# EAGLE design bbps (EAGLE 8.0.1)
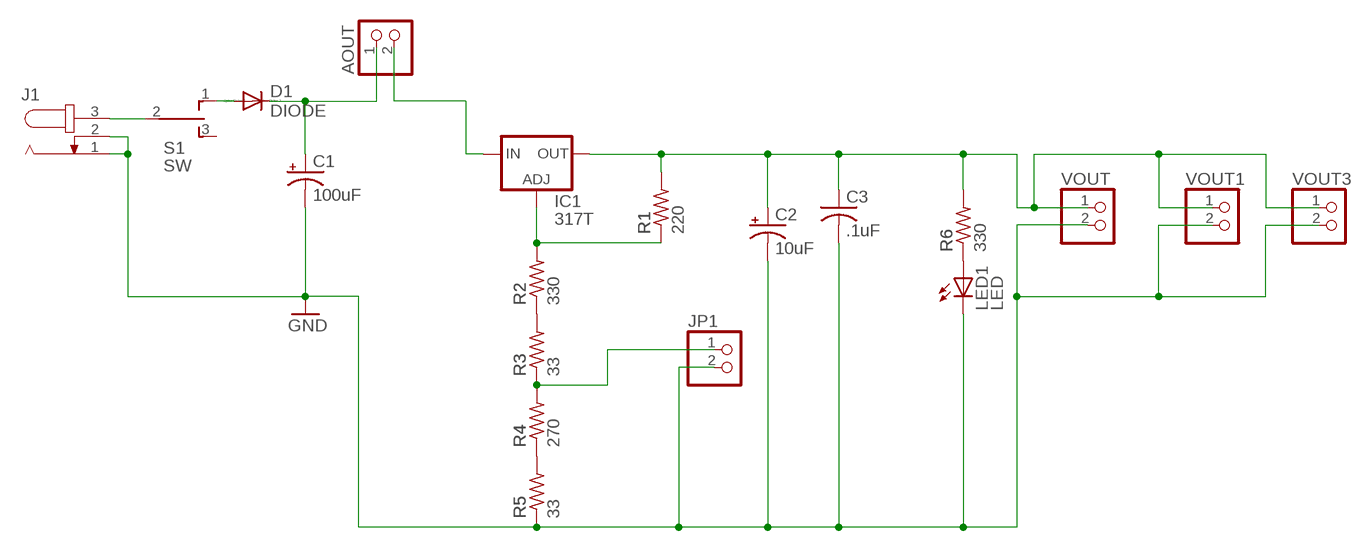
[diagram p0: schematic, sheet 1]

## Parts
AOUT  PINHD-1X2  [1X02]
C1  100uF  CPOL5MM  [CPOL_5MM]
C2  10uF  CPOL5MM  [CPOL_5MM]
C3  .1uF  C-US050-024X044  [C050-024X044]
D1  DIODE  [D40_10MM]
IC1  317T  [317T]
J1  JACK-PLUG0  [SPC4077]
JP1  PINHD-1X2  [1X02]
LED1  LED  [LED_2.54MM]
R1  220  R  [R207_7.6MM]
R2  330  R  [R207_7.6MM]
R3  33  R  [R207_7.6MM]
R4  270  R  [R207_7.6MM]
R5  33  R  [R207_7.6MM]
R6  330  R  [R207_7.6MM]
S1  SW  SWITCH  [SWITCH]
VOUT  PINHD-1X2  [1X02]
VOUT1  PINHD-1X2  [1X02]
VOUT3  PINHD-1X2  [1X02]

## Nets
GND: C1.- C2.- C3.2 J1.1 J1.2 JP1.2 LED1.K(C) R5.1 VOUT1.2 VOUT3.2 VOUT.2
N$1: J1.3 S1.2
N$2: D1.A S1.1
N$3: AOUT.1 C1.+ D1.C
N$4: C2.+ C3.1 IC1.2(OUT) R1.2 R6.2 VOUT1.1 VOUT3.1 VOUT.1
N$5: LED1.A R6.1
N$6: R4.1 R5.2
N$7: R2.1 R3.2
N$8: IC1.1(ADJ) R1.1 R2.2
N$9: JP1.1 R3.1 R4.2
N$10: AOUT.2 IC1.3(IN)
Unconnected: S1.3

## Library data of the parts
AOUT JP1 VOUT VOUT1 VOUT3 = pinhead:PINHD-1X2: PIN HEADER
C1 C2 = myLib:CPOL
C3 = rcl:C-US: CAPACITOR, American symbol
D1 = myLib:DIODE
IC1 = myLib:317T
J1 = con-jack:JACK-PLUG: DC POWER JACK Power Jack, DC, Right Angle, Through Hole, Rated 5A at 16VDC, PC Terminals Distributor: Farnell (www.Farnell.de) Drawing: 84N1161.pdf / 84N1162.pdf Manufacturer: SPC Technology (www.spctechnology.com) Type: SPC4077 / SPC 4078; OC_FARNELL: unknown; OC_NEWARK: unknown
LED1 = myLib:LED
R1-R6 = myLib:R
S1 = myLib:SWITCH

## Board
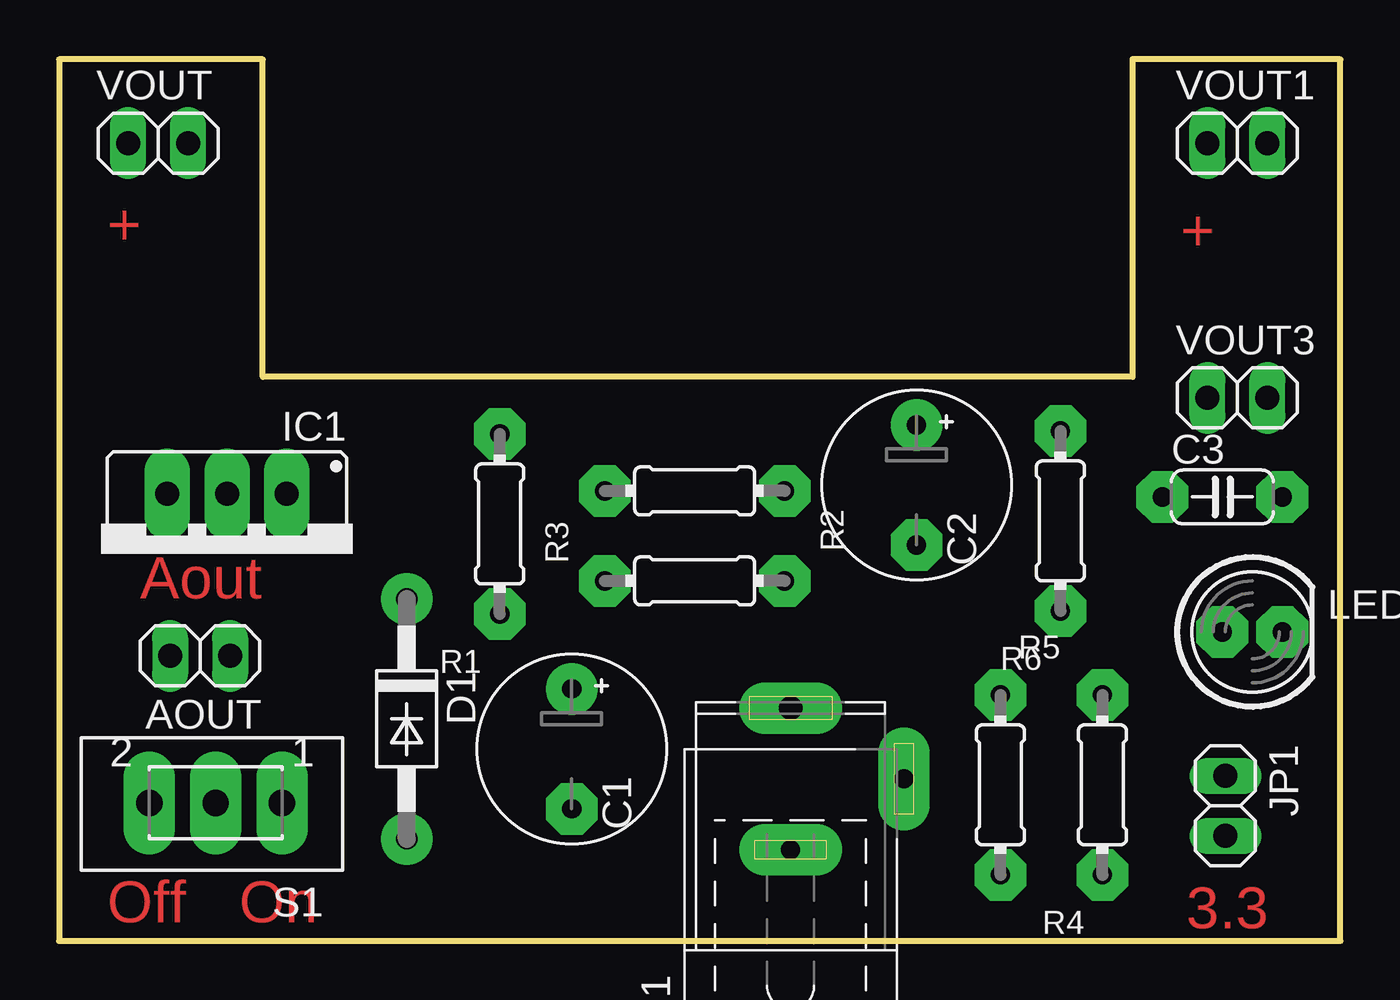
[diagram p1: board, top side]
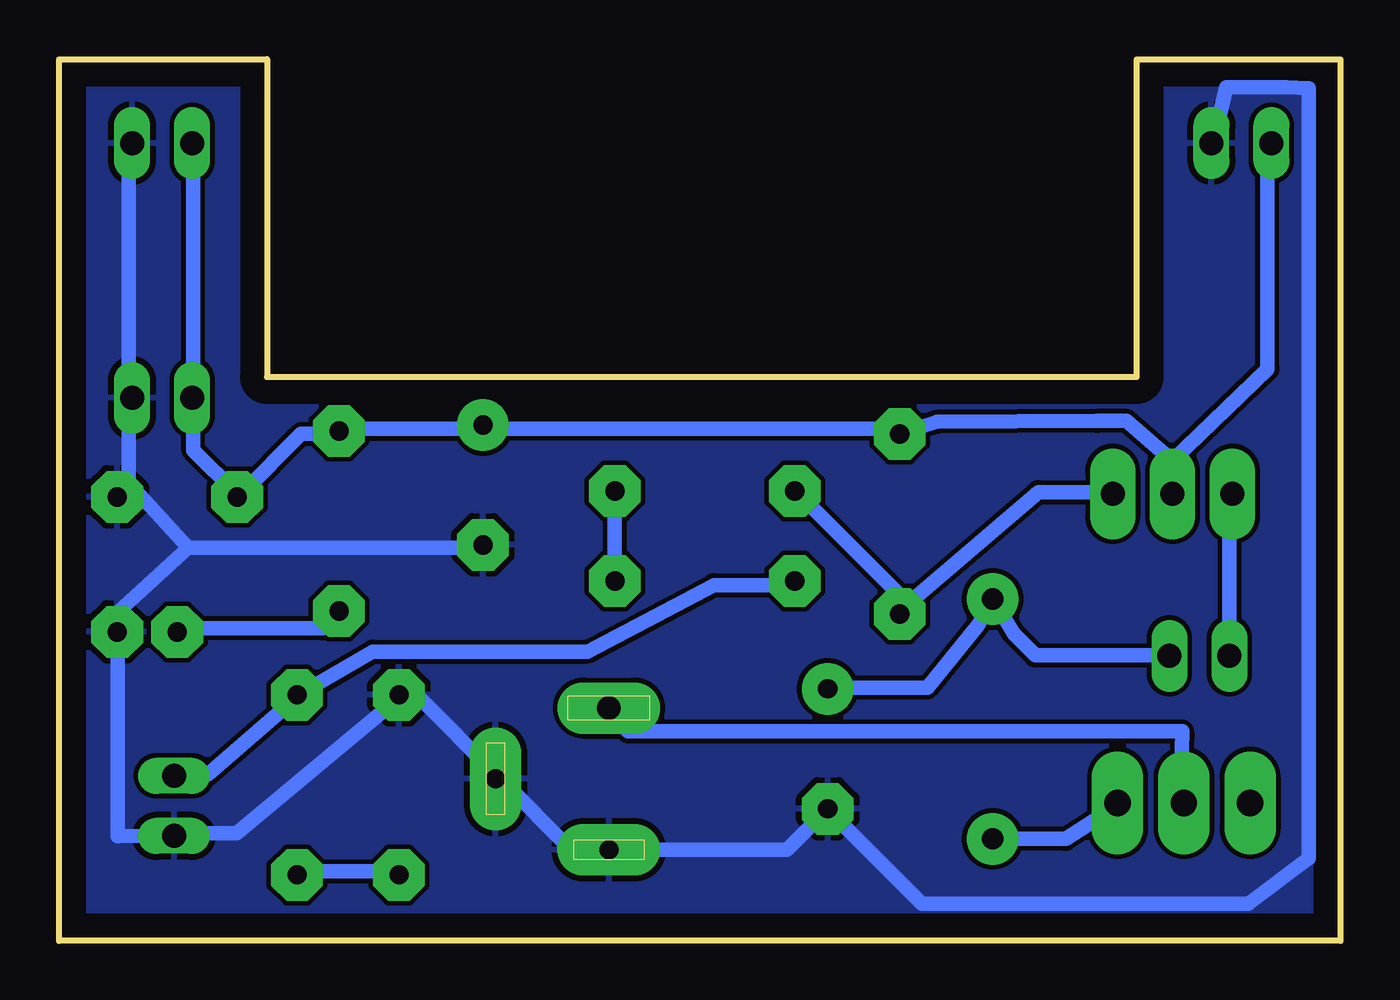
[diagram p2: board, bottom side, seen from below]

Size 54.28 x 37.34 mm. Coordinates in mm from the lower left corner, seen from the top.
Outline: 0,0 54.28,0 54.28,37.33 45.47,37.34 45.47,23.88 8.64,23.88 8.64,37.33 0,37.33 0,0
Copper layers (1*16): Top 0.035mm / dielectric 1.5mm / Bottom 0.035mm
Design rules "default": minimum track width 10mil, minimum drill 24mil, track to track 8mil, track to pad 8mil, pad to pad 8mil, via to via 8mil, smd to smd 8mil, copper to edge 40mil, drill to drill 8mil, minimum pad ring 10mil, minimum via ring 8mil, stop-mask expansion 4mil, vias tented up to drill 0mil, thermal gap 10mil

### Footprints (pad centres in the part's own frame; a part is rotated, then mirrored left to right if it is on the bottom)
1X02 = drill 1.016 long: 1 -1.27,0; 2 1.27,0
CPOL_5MM = drill 0.813 pad 2.184: + -2.54,0 | drill 0.813 pad 2.184 octagon: - 2.54,0
C050-024X044 = drill 0.813 pad 2.184 octagon: 1 -2.54,0; 2 2.54,0
D40_10MM = drill 0.9 pad 2.184: A 5.08,0; C -5.08,0
317T = drill 1.016 pad 1.93 long: 1 -2.54,-2.54; 2 0,-2.54; 3 2.54,-2.54
SPC4077 = drill 0.8 pad 2.184 long: 1 -3,0; 2 0,-4.8 | drill 1 pad 2.184 long: 3 3,0
LED_2.54MM = drill 0.813 pad 2.184 octagon: A -1.27,0; K 1.27,0
R207_7.6MM = drill 0.813 pad 2.184 octagon: 1 -3.81,0; 2 3.81,0
SWITCH = drill 1.118 pad 2.184 long: 1 -2.84,0; 2 -0.03,0; 3 2.78,0

### Placement (x,y rotation side)
AOUT  5.97,12.06 180 top
C1  21.72,8.13 270 top
C2  36.32,19.3 270 top
C3  49.28,18.8 0 top
D1  14.73,9.4 270 top
IC1  7.11,16.38 180 top
J1  30.99,6.86 90 top
JP1  49.4,5.72 270 top
LED1  50.55,13.08 0 top
R1  18.67,17.65 90 top
R2  26.92,19.05 180 top
R3  26.92,15.24 0 top
R4  44.2,6.6 90 top
R5  39.88,6.6 270 top
R6  42.42,17.78 90 top
S1  6.6,5.84 180 top
VOUT  4.19,33.78 0 top
VOUT1  49.91,33.78 0 top
VOUT3  49.91,22.99 0 top

### Tracks (layer width: path | path; a pad name or v marks a point on that pad's centre or on a via)
GND
  Bottom 0.61: 51.33,19.41 51.33,22.84 VOUT3.2 51.33,23.06 51.33,33.58 VOUT1.2 | 51.33,19.41 51.79,18.95 C3.2 51.33,19.41 | 48.82,16.64 36.6,16.64 C2.- | 51.33,19.41 48.82,16.64 | 48.82,16.64 51.79,13.92 51.79,13.23 LED1.K 51.79,13.01 51.79,4.42 JP1.2 49.28,4.55 46.76,4.55 39.9,10.26 R5.1 39.68,10.26 38.99,10.26 35.79,7.06 J1.2 35.56,6.83 32.59,3.86 J1.1 | VOUT.2 5.38,33.81 4.83,36.14 2.29,36.14 1.35,36.09 1.35,3.51 3.91,1.58 17.73,1.58 21.61,5.46 C1.- 23.44,3.86 J1.1 | J1.1
  pour Bottom: 0,37.34 8.64,37.34 8.64,23.88 45.47,23.88 45.47,37.34 54.23,37.34 54.23,0 0,0
N$1
  Bottom 0.61: S1.2 6.76,5.92 6.76,6.38 6.71,8.87 30.18,8.87 30.99,9.8 J1.3
N$2
  Bottom 0.61: D1.A 11.63,4.32 9.5,5.69 S1.1
N$3
  Bottom 0.61: AOUT.1 7.44,12.09 12.93,12.09 13.84,13.01 D1.C 15.34,13.39 17.5,10.72 21.61,10.72 C1.+
N$4
  Bottom 0.61: VOUT1.1 48.59,33.58 48.59,23.06 VOUT3.1 48.59,22.84 48.59,20.78 46.76,18.95 C3.1 46.53,18.95 44.02,21.46 42.42,21.46 R6.2 42.42,21.69 36.47,21.69 C2.+ 36.25,21.69 19.1,21.69 18.87,21.46 R1.2 17.09,21.97 10.31,22.02 9.07,22.02 7.11,20.32 | 7.11,20.32 3.1,24.21 3.1,33.58 VOUT.1 | 7.11,20.32 IC1.2
N$5
  Bottom 0.61: LED1.A 49.28,13.23 43.1,13.23 42.42,13.92 R6.1
N$6
  Bottom 0.61: R5.2 39.9,2.95 44.02,2.95 R4.1
N$7
  Bottom 0.61: R3.2 30.76,15.29 30.76,18.95 R2.1
N$8
  Bottom 0.61: 18.19,14.38 18.64,13.92 R1.1 18.19,14.38 | 18.19,14.38 12.8,19 9.98,19 IC1.1 | 18.19,14.38 18.41,14.38 22.99,18.95 R2.2
N$9
  Bottom 0.61: JP1.1 49.28,7.06 47.96,7.06 44.25,10.26 R4.2 44.02,10.49 41,12.24 31.9,12.24 26.54,15.06 23.22,15.06 R3.1
N$10
  Bottom 0.61: AOUT.2 4.7,18.49 IC1.3

### Text on the board
Top: + | + | Aout | Off | On | 3.3